# Altium project tcspc00.PrjPcb (part 2 of 2)

## Sheet 03_mcu_display.SchDoc
size A; SheetNumber: 14; SheetTotal: 17
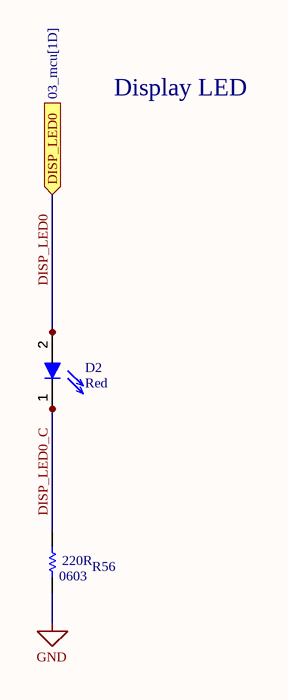
[diagram p8: 03_mcu_display.SchDoc]

### Parts
D2  Red  [DISPLAY-LED]
R56  RMCF0603JT220R  [RES-STACK-POLE-0603]  (value not drawn)

### Ports
DISP_LED0 (in, see 03_mcu[1D])

### Nets
GND: R56.1
DISP_LED0: D2.2 ; port DISP_LED0
DISP_LED0_C: D2.1 R56.2

### Notes on the sheet
- Display LED
- (in symbol RMCF0603JT220R) 220R; 0603

### Library data of the parts
D2 = LTST-C191KRKT: LED RED CLEAR 0603 SMD; Manufacturer: Vishay Lite-On; Lens Color: Colorless; Power Rating: 75mW; Luminous Intensity: 54mcd; Viewing Angle: 130°; Forward Voltage: 2V; Lens Style: Clear,Diffused,Colorless,Rectangular; Forward Current: 30mA; Dominant Wavelength: 631nm; Test Current: 20mA; Number of Elements: 1; Wavelength: 639nm; Reverse Voltage: 5V; Supplier 1: Digi-Key; Manufacturer Part Number: LTST-C191KRKT; RoHS: Yes; Category: LEDs; Stock 1: 515395; Pricing 1: 1=0.26000, 10=0.14100, 100=0.06560, 500=0.06060, 1000=0.04747, 2000=0.04646 (USD); Mount: Surface Mount; Case/Package: 0603; Number of Pins: 2; Color: Red; Case Code (Metric): 1608; Case Code (Imperial): 0603; Min Operating Temperature: -55°C; Max Operating Temperature: 85°C; Packaging: Tape and Reel; Package Quantity: 1; Illumination Color: Red; Lens Transparency: Clear; Power Dissipation: 75mW; Number of LEDs: 1; Voltage: 2V; Length: 1.6mm; Width: 0.8mm; Height: 0.55mm; Depth: 0.8mm; Radiation Hardening: No; Lead Free: Lead Free; RoHS Compliant: Yes; ComponentLink1URL: https://datasheet.ciiva.com/12400/lite-on-ltst-c191krkt-190135-12400910.pdf?src-supplier=Mouser; ComponentLink1Description: https://datasheet.ciiva.com/12400/lite-on-ltst-c191krkt-190135-12400910.pdf?src-supplier=Mouser; ComponentLink2URL: https://datasheet.ciiva.com/16212/ltst-c191krkt-16212419.pdf?src-supplier=Future+Electronics; ComponentLink2Description: https://datasheet.ciiva.com/16212/ltst-c191krkt-16212419.pdf?src-supplier=Future+Electronics; ComponentLink3URL: https://datasheet.ciiva.com/15117/getdatasheetpartid-141922-15117737.pdf?src-supplier=Verical; ComponentLink3Description: https://datasheet.ciiva.com/15117/getdatasheetpartid-141922-15117737.pdf?src-supplier=Verical; ComponentLink4URL: https://datasheet.ciiva.com/11773/0900766b80dc02b2-11773601.pdf?src-supplier=RSComponents; ComponentLink4Description: https://datasheet.ciiva.com/11773/0900766b80dc02b2-11773601.pdf?src-supplier=RSComponents; ComponentLink5URL: https://datasheet.ciiva.com/2109/s-110-ltst-c191krkt-2109970.pdf?src-supplier=Digi-Key; ComponentLink5Description: https://datasheet.ciiva.com/2109/s-110-ltst-c191krkt-2109970.pdf?src-supplier=Digi-Key; ComponentLink6URL: https://datasheet.ciiva.com/2109/s-110-ltst-c191krkt-2109971.pdf?src-supplier=Digi-Key; ComponentLink6Description: https://datasheet.ciiva.com/2109/s-110-ltst-c191krkt-2109971.pdf?src-supplier=Digi-Key; ComponentLink7URL: https://datasheet.ciiva.com/2109/s-110-ltst-c191krkt-2109972.pdf?src-supplier=Digi-Key; ComponentLink7Description: https://datasheet.ciiva.com/2109/s-110-ltst-c191krkt-2109972.pdf?src-supplier=Digi-Key; Supplier Part Number 1: 160-1447-1-ND
R56 = RMCF0603JT220R: RES 220 OHM 5% 1/10W 0603; Supplier 1: Digi-Key; Supplier Part Number 1: RMCF0603JT220RCT-ND

## Sheet 03_mcu_io.SchDoc
size A; SheetNumber: 15; SheetTotal: 17
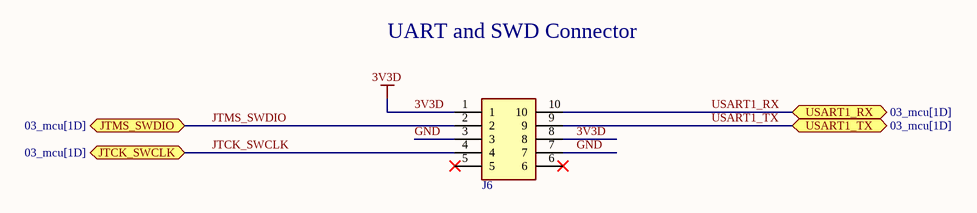
[diagram p9: 03_mcu_io.SchDoc]

### Parts
J6  TC2050-IDC  [TAG-CONNECT_TC2050-IDC]  (value not drawn)

### Ports
JTCK_SWCLK (bidir, see 03_mcu[1D]), JTMS_SWDIO (bidir, see 03_mcu[1D]), USART1_RX (bidir, see 03_mcu[1D]), USART1_TX (bidir, see 03_mcu[1D])

### Nets
3V3D: J6.1 J6.8
GND: J6.3 J6.7
JTCK_SWCLK: J6.4 ; port JTCK_SWCLK
JTMS_SWDIO: J6.2 ; port JTMS_SWDIO
USART1_RX: J6.10 ; port USART1_RX
USART1_TX: J6.9 ; port USART1_TX

Not connected (* = marked no-connect by the designer): J6 5* 6*

### Notes on the sheet
- UART and SWD Connector

### Library data of the parts
J6 = TC2050-IDC: Cbl Plug-Of-Nails 10-Pin w/Legs; Package: None; Availability: Unavailable; Value: *; MP: TC2050-IDC; Price: None

## Sheet 02_power_supply.SchDoc
size A3; SheetNumber: 6; SheetTotal: 17
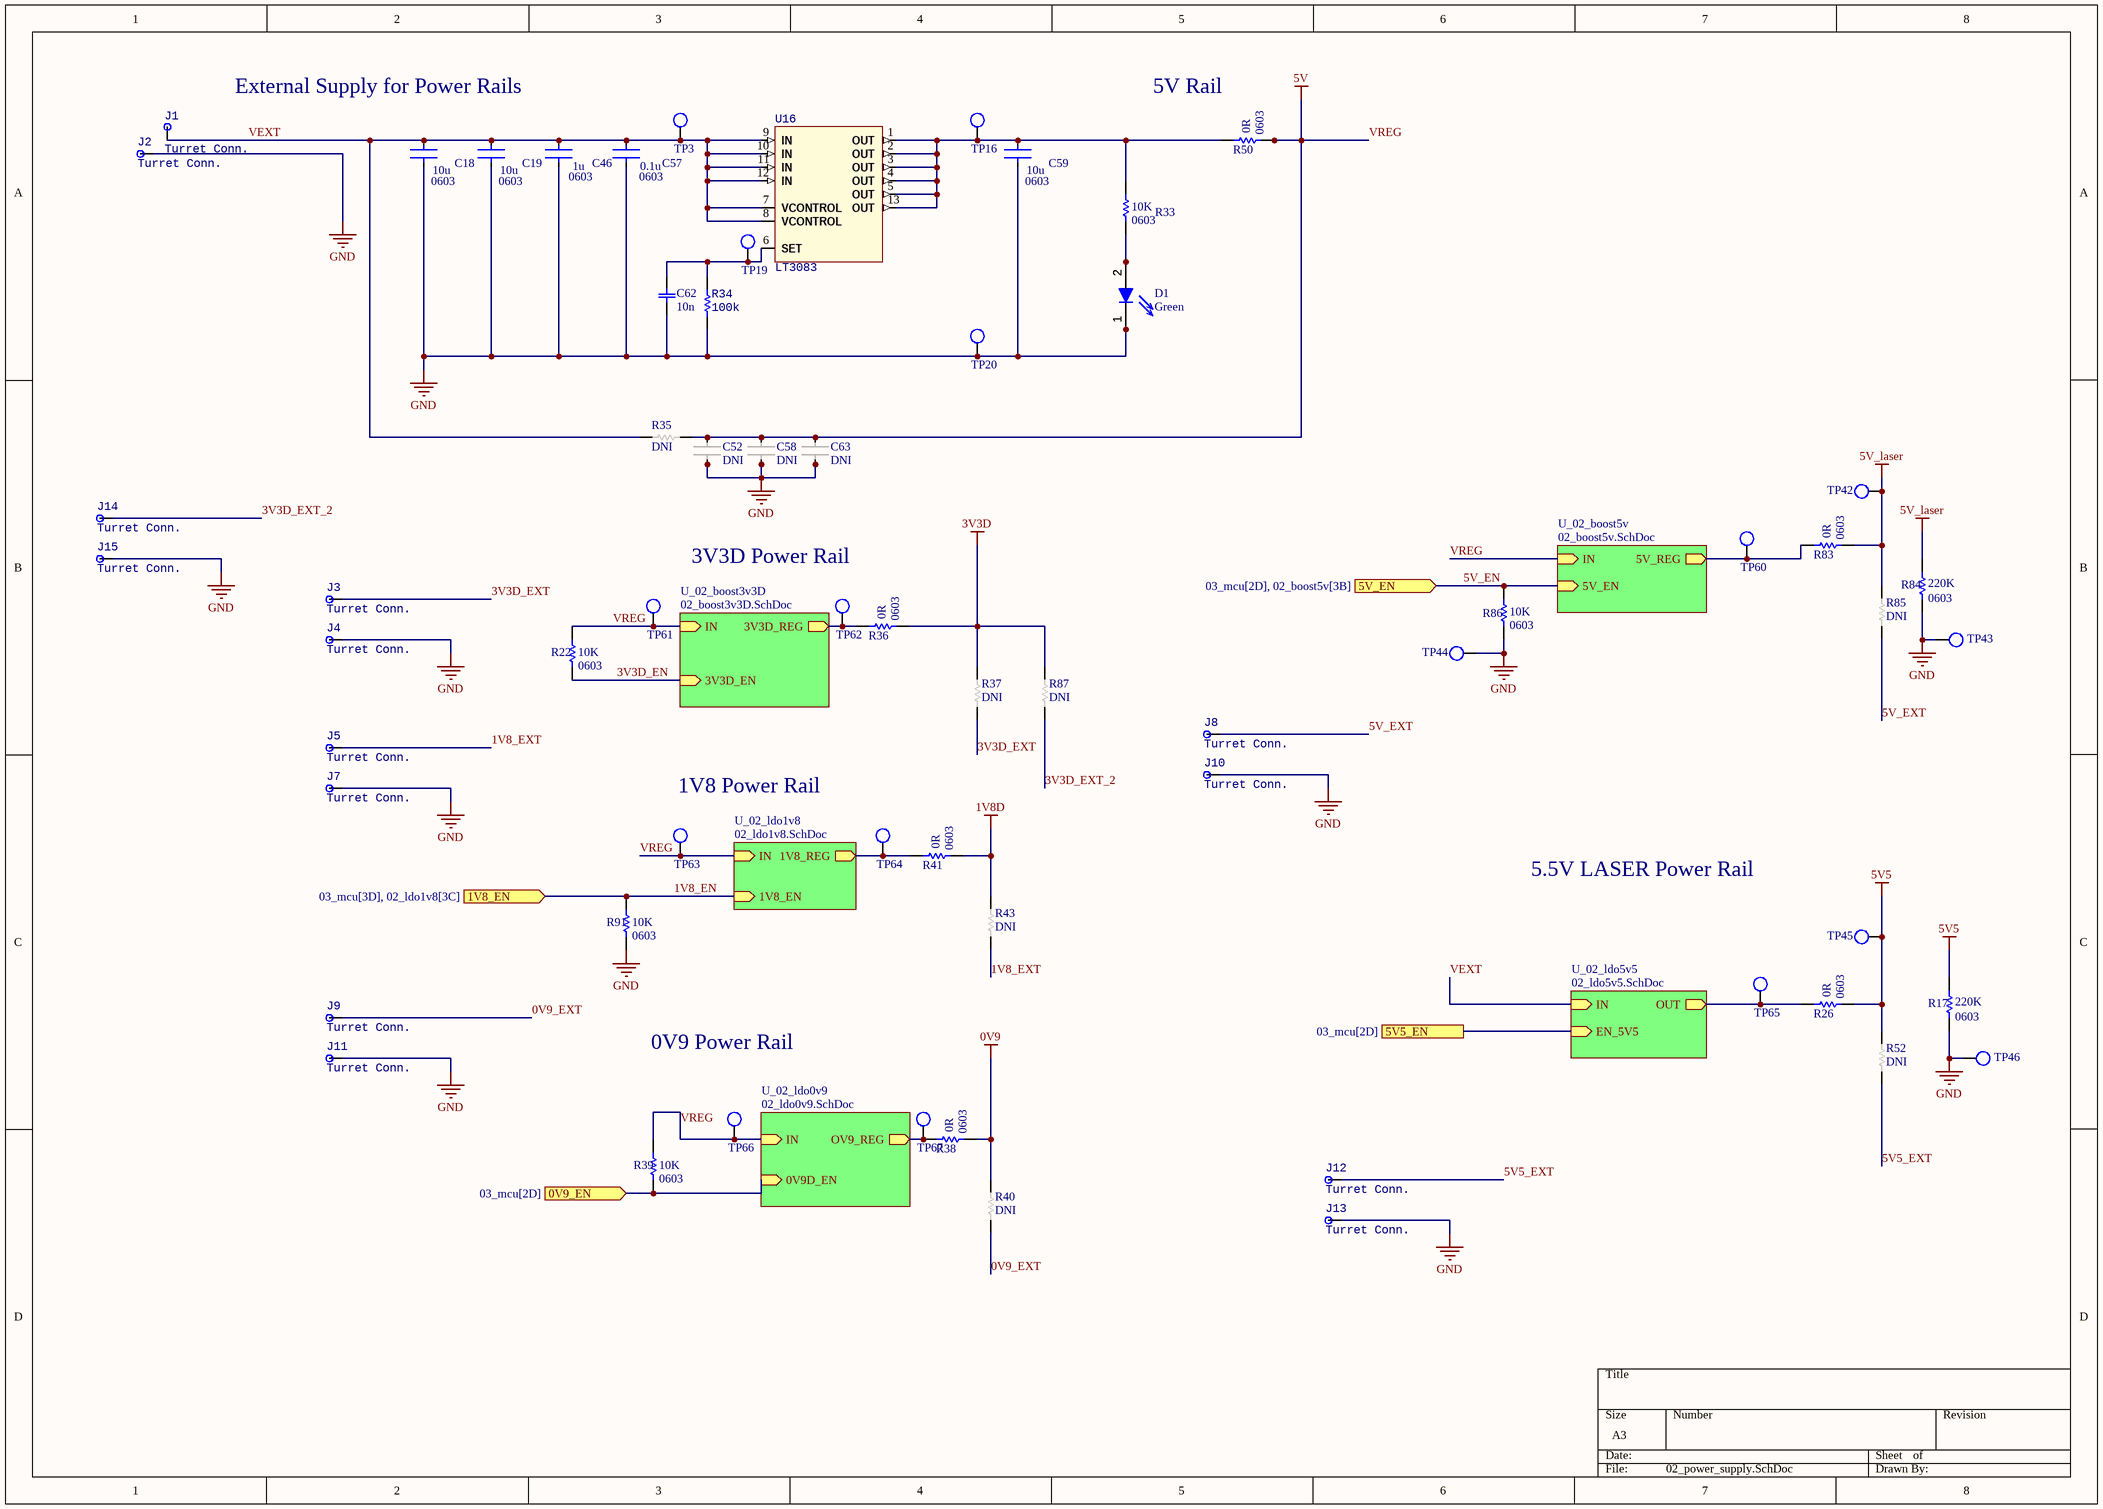
[diagram p10: 02_power_supply.SchDoc]

### Parts
C18  C1608X5R1A106K080AC  [CAPTDK0603]  (value not drawn)
C19  C1608X5R1A106K080AC  [CAPTDK0603]  (value not drawn)
C46  C1608X5R1E105K080AC  [CAPTDK0603]  (value not drawn)
C52  DNI  [CAPTDK0603]  (no BOM)
C57  CGA3E2X7R1H104K080AA  [CAPTDK0603]  (value not drawn)
C58  DNI  [CAPTDK0603]  (no BOM)
C59  C1608X5R1A106K080AC  [CAPTDK0603]  (value not drawn)
C62  10n  [CAP_CL10]
C63  DNI  [CAPTDK0603]  (no BOM)
D1  Green  [DISPLAY-LED]
J1  Turret Conn.  [2501-X]
J2  Turret Conn.  [2501-X]
J3  Turret Conn.  [2501-X]
J4  Turret Conn.  [2501-X]
J5  Turret Conn.  [2501-X]
J7  Turret Conn.  [2501-X]
J8  Turret Conn.  [2501-X]
J9  Turret Conn.  [2501-X]
J10  Turret Conn.  [2501-X]
J11  Turret Conn.  [2501-X]
J12  Turret Conn.  [2501-X]
J13  Turret Conn.  [2501-X]
J14  Turret Conn.  [2501-X]
J15  Turret Conn.  [2501-X]
R17  RMCF0603FT220K  [RES-STACK-POLE-0603]  (value not drawn)
R22  RMCF0603JG10K0  [RES-STACK-POLE-0603]  (value not drawn)
R26  RMCF0603ZT0R00  [RES-STACK-POLE-0603]  (value not drawn)
R33  RMCF0603JG10K0  [RES-STACK-POLE-0603]  (value not drawn)
R34  100k  [RES_0603]
R35  DNI  [RES_0603]
R36  RMCF0603ZT0R00  [RES-STACK-POLE-0603]  (value not drawn)
R37  DNI  [RES_0603]
R38  RMCF0603ZT0R00  [RES-STACK-POLE-0603]  (value not drawn)
R39  RMCF0603JG10K0  [RES-STACK-POLE-0603]  (value not drawn)
R40  DNI  [RES_0603]
R41  RMCF0603ZT0R00  [RES-STACK-POLE-0603]  (value not drawn)
R43  DNI  [RES_0603]
R50  RMCF0603ZT0R00  [RES-STACK-POLE-0603]  (value not drawn)
R52  DNI  [RES_0603]
R83  RMCF0603ZT0R00  [RES-STACK-POLE-0603]  (value not drawn)
R84  RMCF0603FT220K  [RES-STACK-POLE-0603]  (value not drawn)
R85  DNI  [RES_0603]
R86  RMCF0603JG10K0  [RES-STACK-POLE-0603]  (value not drawn)
R87  DNI  [RES_0603]
R91  RMCF0603JG10K0  [RES-STACK-POLE-0603]  (value not drawn)
TP3  TESTPOINT_S  [TESTPOINT_S]  (value not drawn)  (no BOM)
TP16  TESTPOINT_S  [TESTPOINT_S]  (value not drawn)  (no BOM)
TP19  TESTPOINT_S  [TESTPOINT_S]  (value not drawn)  (no BOM)
TP20  TESTPOINT_S  [TESTPOINT_S]  (value not drawn)  (no BOM)
TP42  TESTPOINT_S  [TESTPOINT_S]  (value not drawn)  (no BOM)
TP43  TESTPOINT_S  [TESTPOINT_S]  (value not drawn)  (no BOM)
TP44  TESTPOINT_S  [TESTPOINT_S]  (value not drawn)  (no BOM)
TP45  TESTPOINT_S  [TESTPOINT_S]  (value not drawn)  (no BOM)
TP46  TESTPOINT_S  [TESTPOINT_S]  (value not drawn)  (no BOM)
TP60  TESTPOINT_S  [TESTPOINT_S]  (value not drawn)  (no BOM)
TP61  TESTPOINT_S  [TESTPOINT_S]  (value not drawn)  (no BOM)
TP62  TESTPOINT_S  [TESTPOINT_S]  (value not drawn)  (no BOM)
TP63  TESTPOINT_S  [TESTPOINT_S]  (value not drawn)  (no BOM)
TP64  TESTPOINT_S  [TESTPOINT_S]  (value not drawn)  (no BOM)
TP65  TESTPOINT_S  [TESTPOINT_S]  (value not drawn)  (no BOM)
TP66  TESTPOINT_S  [TESTPOINT_S]  (value not drawn)  (no BOM)
TP67  TESTPOINT_S  [TESTPOINT_S]  (value not drawn)  (no BOM)
U16  LT3083  [DF-12_LT3083]

### Sub-sheets
U_02_boost3v3D = 02_boost3v3D.SchDoc: IN (in), 3V3D_EN (in), 3V3D_REG (out)
U_02_boost5v = 02_boost5v.SchDoc: IN (in), 5V_EN (in), 5V_REG (out)
U_02_ldo0v9 = 02_ldo0v9.SchDoc (file not in this document): IN (in), 0V9D_EN (in), OV9_REG (out)
U_02_ldo1v8 = 02_ldo1v8.SchDoc: IN (in), 1V8_EN (in), 1V8_REG (out)
U_02_ldo5v5 = 02_ldo5v5.SchDoc: IN (in), OUT (out), EN_5V5 (in)

### Ports
0V9_EN (in, see 03_mcu[2D]), 1V8_EN (in, see 03_mcu[3D], 02_ldo1v8[3C]), 5V5_EN (see 03_mcu[2D]), 5V_EN (in, see 03_mcu[2D], 02_boost5v[3B])

### Nets
0V9: R38.1 R40.1
1V8D: R41.1 R43.1
3V3D: R36.1 R37.1 R87.1
5V5: R17.2 R26.1 R52.1 TP45.1
5V_laser: R83.1 R84.2 R85.1 TP42.1
GND: C18.2 C19.2 C46.2 C52.2 C57.2 C58.2 C59.2 C62.1 C63.2 D1.1 J2.1 J4.1 J7.1 J10.1 J11.1 J13.1 J15.1 R17.1 R34.1 R84.1 R86.1 R91.1 TP20.1 TP43.1 TP44.1 TP46.1
VREG: C52.1 C58.1 C63.1 R22.2 R35.2 R39.2 R50.1 TP61.1 TP63.1 TP66.1 ; sheet U_02_ldo1v8/IN, sheet U_02_boost3v3D/IN, sheet U_02_ldo0v9/IN, sheet U_02_boost5v/IN  [also labelled 5V]
0V9_EN: R39.1 ; port 0V9_EN, sheet U_02_ldo0v9/0V9D_EN
0V9_EXT: J9.1 R40.2
1V8_EN: R91.2 ; port 1V8_EN, sheet U_02_ldo1v8/1V8_EN
1V8_EXT: J5.1 R43.2
3V3D_EN: R22.1 ; sheet U_02_boost3v3D/3V3D_EN
3V3D_EXT: J3.1 R37.2
3V3D_EXT_2: J14.1 R87.2
5V5_EN: port 5V5_EN, sheet U_02_ldo5v5/EN_5V5
5V5_EXT: J12.1 R52.2
5V_EN: R86.2 ; port 5V_EN, sheet U_02_boost5v/5V_EN
5V_EXT: J8.1 R85.2
VEXT: C18.1 C19.1 C46.1 C57.1 J1.1 R35.1 TP3.1 U16.7(VCONTROL) U16.8(VCONTROL) U16.9(IN) U16.10(IN) U16.11(IN) U16.12(IN) ; sheet U_02_ldo5v5/IN
NetC40_1: R41.2 TP64.1 ; sheet U_02_ldo1v8/1V8_REG
NetC43_1: R36.2 TP62.1 ; sheet U_02_boost3v3D/3V3D_REG
NetC59_1: C59.1 R33.2 R50.2 TP16.1 U16.1(OUT) U16.2(OUT) U16.3(OUT) U16.4(OUT) U16.5(OUT) U16.13(OUT)
NetC62_2: C62.2 R34.2 TP19.1 U16.6(SET)
NetC116_1: R83.2 TP60.1 ; sheet U_02_boost5v/5V_REG
NetC120_1: R26.2 TP65.1 ; sheet U_02_ldo5v5/OUT
NetD1_2: D1.2 R33.1
NetR38_2: R38.2 TP67.1 ; sheet U_02_ldo0v9/OV9_REG

### Notes on the sheet
- External Supply for Power Rails
- (near R50) 5V Rail
- 3V3D Power Rail
- 1V8 Power Rail
- 5.5V LASER Power Rail
- 0V9 Power Rail
- (in symbol C1608X5R1A106K080AC) 10u; 0603
- (in symbol C1608X5R1E105K080AC) 1u; 0603
- (in symbol CGA3E2X7R1H104K080AA) 0.1u; 0603
- (in symbol RMCF0603FT220K) 220K; 0603
- (in symbol RMCF0603JG10K0) 10K; 0603
- (in symbol RMCF0603ZT0R00) 0R; 0603

### Library data of the parts
C18 C19 C59 = C1608X5R1A106K080AC: CAP CER 10UF 10V X5R 0603; Supplier 1: Digi-Key; Supplier Part Number 1: 445-C1608X5R1A106K080ACCT-ND
C46 = C1608X5R1E105K080AC: CAP CER 1UF 25V X5R 0603; Supplier 1: Digi-Key; Supplier Part Number 1: 445-5146-1-ND
C52 C58 C63 = C0402_PROVISION: CAP PROVISION 0603; Value: DNI
C57 = CGA3E2X7R1H104K080AA: CAP CER 0.1UF 50V X7R 0603; Supplier 1: Digi-Key; Supplier Part Number 1: 445-5666-1-ND
C62 = CC0603KRX7R9BB103: CAP CER 10NF 50V X7R 0603; Manufacturer: Yageo; Material: Ceramic; Tolerance: 10%; Insulation Resistance: 100GR; Supplier 1: Digi-Key; Manufacturer Part Number: CC0603KRX7R9BB103; RoHS: Yes; Category: Ceramic Capacitors; Stock 1: 11591344; Pricing 1: 4000=0.00734, 8000=0.00670 (USD); Mount: Surface Mount; Case/Package: 0603; Number of Pins: 2; Case Code (Metric): 1608; Case Code (Imperial): 0603; Min Operating Temperature: -55°C; Max Operating Temperature: 125°C; Capacitance: 10nF; Dielectric: X7R; Voltage: 50V; Packaging: Tape and Reel; Voltage Rating: 50V; Voltage Rating (DC): 50V; Package Quantity: 1; Termination: SMD/SMT; Resistor Type: Ceramic; Series: CC; Length: 1.6mm; Width: 0.031inch; Height: 0.8mm; Thickness: 0.035inch; Depth: 0.8mm; Radiation Hardening: No; RoHS Compliant: Yes; REACH SVHC: No SVHC; Lead Free: Lead Free; Halogen Free: Halogen Free; ComponentLink1URL: https://datasheet.ciiva.com/11788/0900766b8079c870-11788374.pdf?src-supplier=RSComponents; ComponentLink1Description: https://datasheet.ciiva.com/11788/0900766b8079c870-11788374.pdf?src-supplier=RSComponents; ComponentLink2URL: https://datasheet.ciiva.com/26862/getdatasheetpartid-403582-26862846.pdf?src-supplier=Verical; ComponentLink2Description: https://datasheet.ciiva.com/26862/getdatasheetpartid-403582-26862846.pdf?src-supplier=Verical; ComponentLink3URL: https://datasheet.ciiva.com/8033/70765-8033817.pdf?src-supplier=Element14; ComponentLink3Description: https://datasheet.ciiva.com/8033/70765-8033817.pdf?src-supplier=Element14; ComponentLink4URL: https://datasheet.ciiva.com/28450/1489800-28450619.pdf?src-supplier=Element14; ComponentLink4Description: https://datasheet.ciiva.com/28450/1489800-28450619.pdf?src-supplier=Element14; ComponentLink5URL: https://datasheet.ciiva.com/176/mlccorderingcode-176551.pdf?src-supplier=Digi-Key; ComponentLink5Description: https://datasheet.ciiva.com/176/mlccorderingcode-176551.pdf?src-supplier=Digi-Key; ComponentLink6URL: https://datasheet.ciiva.com/176/mlccorderingcode-176550.pdf?src-supplier=Digi-Key; ComponentLink6Description: https://datasheet.ciiva.com/176/mlccorderingcode-176550.pdf?src-supplier=Digi-Key; ComponentLink7URL: https://datasheet.ciiva.com/176/mlccorderingcode-176552.pdf?src-supplier=Digi-Key; ComponentLink7Description: https://datasheet.ciiva.com/176/mlccorderingcode-176552.pdf?src-supplier=Digi-Key; ComponentLink8URL: https://datasheet.ciiva.com/13389/upy-gphc-x7r-6-3v-to-50v-8-13389991.pdf?src-supplier=Mouser; ComponentLink8Description: https://datasheet.ciiva.com/13389/upy-gphc-x7r-6-3v-to-50v-8-13389991.pdf?src-supplier=Mouser; ComponentLink9URL: https://datasheet.ciiva.com/8033/1734573-8033816.pdf?src-supplier=Element14; ComponentLink9Description: https://datasheet.ciiva.com/8033/1734573-8033816.pdf?src-supplier=Element14; ComponentLink10URL: https://datasheet.ciiva.com/8033/1734573-8033861.pdf?src-supplier=Element14; ComponentLink10Description: https://datasheet.ciiva.com/8033/1734573-8033861.pdf?src-supplier=Element14; ComponentLink11URL: https://datasheet.ciiva.com/16625/upy-gphc-x7r-6-3v-to-50v-8-16625529.pdf?src-supplier=Avnet+Europe; ComponentLink11Description: https://datasheet.ciiva.com/16625/upy-gphc-x7r-6-3v-to-50v-8-16625529.pdf?src-supplier=Avnet+Europe; Supplier Part Number 1: 311-1085-2-ND; Value: 10nF
D1 = LTST-C191KGKT: LED GREEN CLEAR 0603  SMD; Supplier 1: Digi-Key; Supplier Part Number 1: 160-1446-1-ND
J1-J5 J7-J15 = 2501-2-00-80-00-00-07-0: TERM TURRET SINGLE L=5.56MM TIN; Manufacturer: Mill-Max; Gender: Male; Outside Diameter: 3.18mm; Hole Diameter: 0.094inch; Board Thickness: 1.57mm; Mounting Hole Diameter: 2.39mm; Pin Diameter: 0.047inch; Supplier 1: Digi-Key; Manufacturer Part Number: 2501-2-00-80-00-00-07-0; RoHS: Yes; Category: Terminals; Stock 1: 31575; Pricing 1: 1=0.26000, 10=0.22000, 25=0.19520, 50=0.18200, 100=0.16900, 250=0.14952, 500=0.14300, 1000=0.11701, 2500=0.10726 (USD); Mount: Through Hole; Material: Brass; Plating: Tin; Package Quantity: 500; Packaging: Bulk; Length: 0.328inch; Lead Free: Lead Free; RoHS Compliant: Yes; ComponentLink1URL: https://datasheet.ciiva.com/12487/2501-2-00-80-00-00-07-0-89719-12487471.pdf?src-supplier=Mouser; ComponentLink1Description: https://datasheet.ciiva.com/12487/2501-2-00-80-00-00-07-0-89719-12487471.pdf?src-supplier=Mouser; Supplier Part Number 1: ED90581-ND
R17 R84 = RMCF0603FT220K: RES 220K OHM 1% 1/10W 0603; Supplier 1: Digi-Key; Supplier Part Number 1: RMCF0603FT220KCT-ND
R22 R33 R39 R86 R91 = RMCF0603JG10K0: RES 10K OHM 5% 1/10W 0603; Supplier 1: Digi-Key; Supplier Part Number 1: 738-RMCF0603JG10K0CT-ND
R26 R36 R38 R41 R50 R83 = RMCF0603ZT0R00: RES 0 OHM JUMPER 1/10W 0603; Supplier 1: Digi-Key; Supplier Part Number 1: RMCF0603ZT0R00CT-ND
R34 = RMCF0603FT100K_1: RES 100K OHM 1% 1/10W 0603; Manufacturer: Stackpole Electronics; Resistance: 100kR; Power Rating: 100mW; Temperature Coefficient: 100ppm/°C; Working Voltage: 75V; Supplier 1: Digi-Key; Manufacturer Part Number: RMCF0603FT100K; RoHS: Yes; Category: Chip SMD Resistors; Stock 1: 8267885; Pricing 1: 1=0.10000, 10=0.01700, 100=0.00680, 1000=0.00305, 2500=0.00264 (USD); Mount: Surface Mount; Case/Package: 0603; Case Code (Metric): 1608; Case Code (Imperial): 0603; Contact Plating: Tin,Matte; Min Operating Temperature: -55°C; Max Operating Temperature: 155°C; Packaging: Tape and Reel; Series: RMCF; Tolerance: 1%; Resistor Type: Thick Film; Number of Terminations: 2; Max Power Dissipation: 100mW; Features: Automotive AEC-Q200; Construction: Rectangular; Length: 1.55mm; Width: 0.031inch; Height: 0.022inch; Depth: 0.8mm; Radiation Hardening: No; Military Standard: Not; Lead Free: Lead Free; RoHS Compliant: Yes; ComponentLink1URL: https://datasheet.ciiva.com/15193/getdatasheetpartid-362597-15193437.pdf?src-supplier=Verical; ComponentLink1Description: https://datasheet.ciiva.com/15193/getdatasheetpartid-362597-15193437.pdf?src-supplier=Verical; Supplier Part Number 1: RMCF0603FT100KCT-ND
R35 R37 R40 R43 R52 R85 R87 = R0603: RES DNI 0603
TP3 TP16 TP19 TP20 TP42-TP46 TP60-TP67 = TESTPOINT_S: Testpoint Surface Pad
U16 = LT3083EDF#PBF: IC REG LINEAR POS ADJ 3A 12DFN; Supplier 1: Digikey; Supplier Part Number 1: 505-LT3083EDF#PBF-ND

## Sheet 02_ldo1v8.SchDoc
size A; SheetNumber: 7; SheetTotal: 17
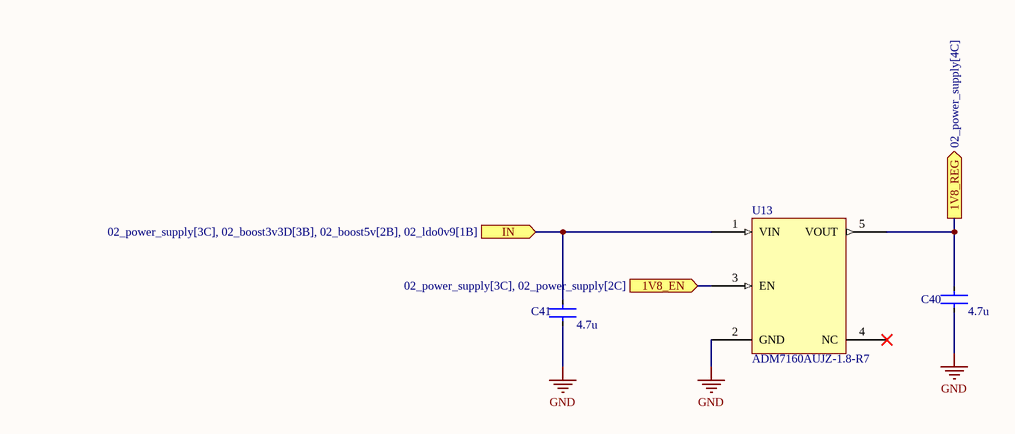
[diagram p11: 02_ldo1v8.SchDoc]

### Parts
C40  C1608X5R1E475K080AC  [CAPTDK0603]  (value not drawn)
C41  C1608X5R1E475K080AC  [CAPTDK0603]  (value not drawn)
U13  ADM7160AUJZ-1.8-R7  [ADM7160]

### Ports
1V8_EN (in, see 02_power_supply[3C], 02_power_supply[2C]), 1V8_REG (out, see 02_power_supply[4C]), IN (in, see 02_power_supply[3C], 02_boost3v3D[3B], 02_boost5v[2B], 02_ldo0v9[1B])

### Nets
GND: C40.2 C41.2 U13.2(GND)
VREG: C41.1 U13.1(VIN) ; port IN
1V8_EN: U13.3(EN) ; port 1V8_EN
NetC40_1: C40.1 U13.5(VOUT) ; port 1V8_REG

Not connected (* = marked no-connect by the designer): U13 4(NC)*

### Notes on the sheet
- (in symbol C1608X5R1E475K080AC) 4.7u

### Library data of the parts
C40 C41 = C1608X5R1E475K080AC: CAP CER 4.7UF 25V X5R 0603; Supplier 1: Digi-Key; Supplier Part Number 1: 445-9050-1-ND
U13 = ADM7160AUJZ-1.8-R7: IC REG LINEAR 1.8V 200MA TSOT5; Manufacturer: Analog Devices; Number of Regulators: 1; Min Current Limit: 220mA; Polarity: Positive; Quiescent Current: 10uA; Min Input Voltage: 2.2V; Accuracy: 1%; Max Input Voltage: 5.5V; Power Supply Rejection Ratio (PSRR): 49dB; Max Supply Current: 265uA; Output Type: Fixed; Supplier 1: Digi-Key; Manufacturer Part Number: ADM7160AUJZ-1.8-R7; RoHS: Yes; Category: Voltage Regulators - Linear; Stock 1: 830; Pricing 1: 1=1.57000, 10=1.40700, 25=1.33560, 100=1.09710, 250=1.02556, 500=0.90630, 1000=0.71550 (USD); Mount: Surface Mount; Case/Package: TSOT; Number of Pins: 5; Contact Plating: Tin,Matte; Min Operating Temperature: -40°C; Max Operating Temperature: 125°C; Packaging: Tape and Reel; Output Voltage: 1.8V; Output Current: 200mA; Number of Outputs: 1; Max Output Current: 200mA; Lead Free: Contains Lead; RoHS Compliant: Yes; ComponentLink1URL: http://www.analog.com/static/imported-files/data_sheets/ADM7160.pdf?src-supplier=Avnet; ComponentLink1Description: http://www.analog.com/static/imported-files/data_sheets/ADM7160.pdf?src-supplier=Avnet; ComponentLink2URL: http://www.analog.com/media/en/technical-documentation/data-sheets/ADM7160.pdf?src-supplier=Digi-Key; ComponentLink2Description: http://www.analog.com/media/en/technical-documentation/data-sheets/ADM7160.pdf?src-supplier=Digi-Key; ComponentLink3URL: https://www.analog.com/media/en/technical-documentation/data-sheets/ADM7160.pdf?src-supplier=Digi-Key; ComponentLink3Description: https://www.analog.com/media/en/technical-documentation/data-sheets/ADM7160.pdf?src-supplier=Digi-Key; Supplier Part Number 1: ADM7160AUJZ-1.8-R7CT-ND

## Sheet 02_boost3v3D.SchDoc
size A; SheetNumber: 8; SheetTotal: 17
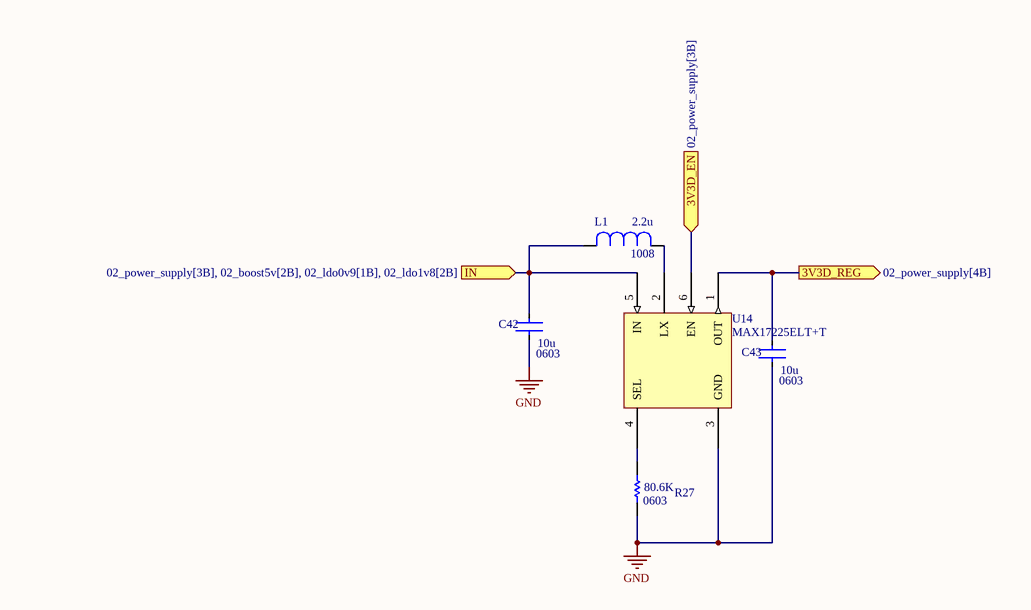
[diagram p12: 02_boost3v3D.SchDoc]

### Parts
C42  C1608X5R1A106K080AC  [CAPTDK0603]  (value not drawn)
C43  C1608X5R1A106K080AC  [CAPTDK0603]  (value not drawn)
L1  DFE252012P-2R2M=P2  [INDMURT1008]  (value not drawn)
R27  RMCF0603FT80K6  [RES-STACK-POLE-0603]  (value not drawn)
U14  MAX17225ELT+T  [MAX17222ELT+T]

### Ports
3V3D_EN (in, see 02_power_supply[3B]), 3V3D_REG (out, see 02_power_supply[4B]), IN (in, see 02_power_supply[3B], 02_boost5v[2B], 02_ldo0v9[1B], 02_ldo1v8[2B])

### Nets
GND: C42.2 C43.2 R27.1 U14.3(GND)
VREG: C42.1 L1.2 U14.5(IN) ; port IN
3V3D_EN: U14.6(EN) ; port 3V3D_EN
NetC43_1: C43.1 U14.1(OUT) ; port 3V3D_REG
NetL1_1: L1.1 U14.2(LX)
NetR27_2: R27.2 U14.4(SEL)

### Notes on the sheet
- (in symbol C1608X5R1A106K080AC) 10u; 0603
- (in symbol DFE252012P-2R2M=P2) 2.2u; 1008
- (in symbol RMCF0603FT80K6) 80.6K; 0603

### Library data of the parts
C42 C43 = C1608X5R1A106K080AC: CAP CER 10UF 10V X5R 0603; Supplier 1: Digi-Key; Supplier Part Number 1: 445-C1608X5R1A106K080ACCT-ND
L1 = DFE252012P-2R2M=P2: FIXED IND 2.2UH 2.2A 84 MOHM SMD; Mfr_Name: Murata; Type: DEV; Copyright: Copyright (C) 2022 Ultra Librarian. All rights reserved.; Manufacturer_Part_Number: DFE252012P-2R2M=P2; Digi-Key_Part_Number_1: 490-10649-1-ND; Digi-Key_Part_Number_2: 490-10649-2-ND; Digi-Key_Part_Number_3: 490-10649-6-ND; RefDes: RefDes; Supplier 1: Digi-Key; Supplier Part Number 1: 490-10649-1-ND
R27 = RMCF0603FT80K6: RES 80.6K OHM 1% 1/10W 0603; Mfr_Name: Stackpole International; Copyright: Copyright (C) 2022 Ultra Librarian. All rights reserved.; Manufacturer_Part_Number: RMCF0603FT80K6; Digi-Key_Part_Number_1: RMCF0603FT80K6CT-ND; Digi-Key_Part_Number_2: RMCF0603FT80K6DKR-ND; Digi-Key_Part_Number_3: RMCF0603FT80K6TR-ND; RefDes: RefDes; Type: DEV; Supplier 1: Digi-Key; Supplier Part Number 1: RMCF0603FT80K6CT-ND
U14 = MAX17225ELT+T: IC REG 0.9V TO 5V 1A 6UDFN; Mfr_Name: Maxim Integrated Products; Copyright: Copyright (C) 2022 Ultra Librarian. All rights reserved.; Manufacturer_Part_Number: MAX17225ELT+T; Digi-Key_Part_Number_1: MAX17225ELT+TTR-ND; Digi-Key_Part_Number_2: MAX17225ELT+TCT-ND; Digi-Key_Part_Number_3: MAX17225ELT+TDKR-ND; RefDes: RefDes; Type: DEV; Supplier 1: Mouser; Supplier Part Number 1: 700-MAX17225ELT+T

## Sheet 02_boost5v.SchDoc
size A; SheetNumber: 10; SheetTotal: 17
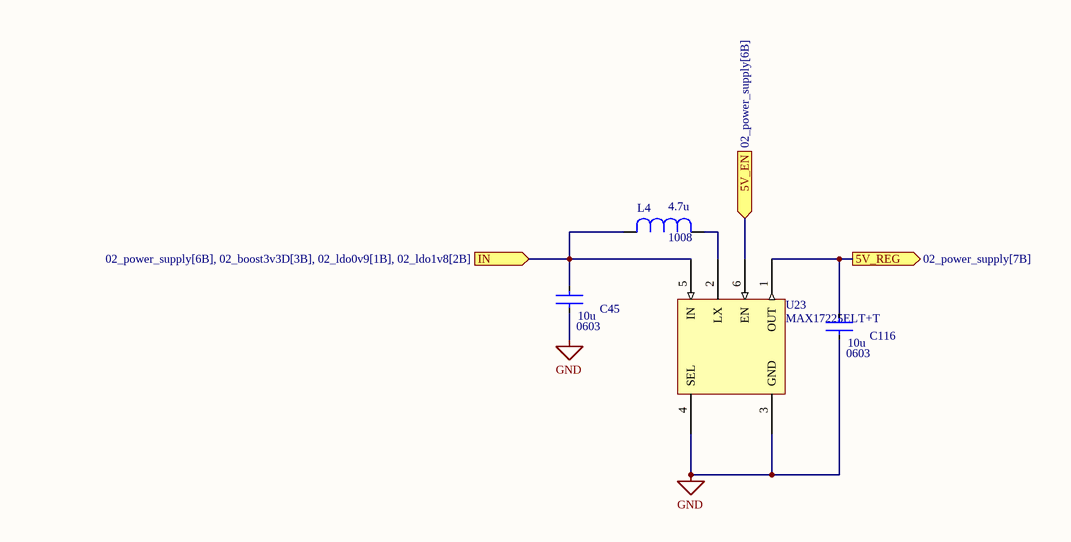
[diagram p13: 02_boost5v.SchDoc]

### Parts
C45  C1608X5R1A106K080AC  [CAPTDK0603]  (value not drawn)
C116  C1608X5R1A106K080AC  [CAPTDK0603]  (value not drawn)
L4  1269AS-H-4R7M=P2  [INDMURT1008]  (value not drawn)
U23  MAX17225ELT+T  [MAX17222ELT+T]

### Ports
5V_EN (in, see 02_power_supply[6B]), 5V_REG (out, see 02_power_supply[7B]), IN (in, see 02_power_supply[6B], 02_boost3v3D[3B], 02_ldo0v9[1B], 02_ldo1v8[2B])

### Nets
GND: C45.2 C116.2 U23.3(GND) U23.4(SEL)
VREG: C45.1 L4.2 U23.5(IN) ; port IN
5V_EN: U23.6(EN) ; port 5V_EN
NetC116_1: C116.1 U23.1(OUT) ; port 5V_REG
NetL4_1: L4.1 U23.2(LX)

### Notes on the sheet
- (in symbol 1269AS-H-4R7M=P2) 4.7u; 1008
- (in symbol C1608X5R1A106K080AC) 10u; 0603

### Library data of the parts
C45 C116 = C1608X5R1A106K080AC: CAP CER 10UF 10V X5R 0603; Supplier 1: Digi-Key; Supplier Part Number 1: 445-C1608X5R1A106K080ACCT-ND
L4 = 1269AS-H-4R7M=P2: FIXED IND 4.7UH 1.3A 300MOHM SMD; MF: Murata Electronics; Check_prices: https://www.snapeda.com/parts/1269AS-H-4R7M=P2/Murata%20Electronics%20North%20America/view-part/1502620/?ref=eda; Digi-Key_Part_Number: 490-10577-1-ND; SnapEDA_Link: https://www.snapeda.com/parts/1269AS-H-4R7M=P2/Murata%20Electronics%20North%20America/view-part/1502620/?ref=snap; Value: *; MP: 1269AS-H-4R7M=P2; Package: 2520 Murata; Purchase-URL: https://pricing.snapeda.com/search/part/1269AS-H-4R7M=P2/?ref=eda; Supplier 1: Digi-Key; Supplier Part Number 1: 490-10577-1-ND
U23 = MAX17225ELT+T: as U14 on sheet 02_boost3v3D; Copyright: Copyright (C) 2022 Ultra Librarian. All rights reserved.; Manufacturer_Part_Number: MAX17225ELT+T; Digi-Key_Part_Number_1: MAX17225ELT+TTR-ND; Digi-Key_Part_Number_2: MAX17225ELT+TCT-ND; Digi-Key_Part_Number_3: MAX17225ELT+TDKR-ND; RefDes: RefDes; Type: DEV; Supplier 1: Mouser; Supplier Part Number 1: 700-MAX17225ELT+T

## Sheet 02_ldo5v5.SchDoc
size A; SheetNumber: 10; SheetTotal: 18
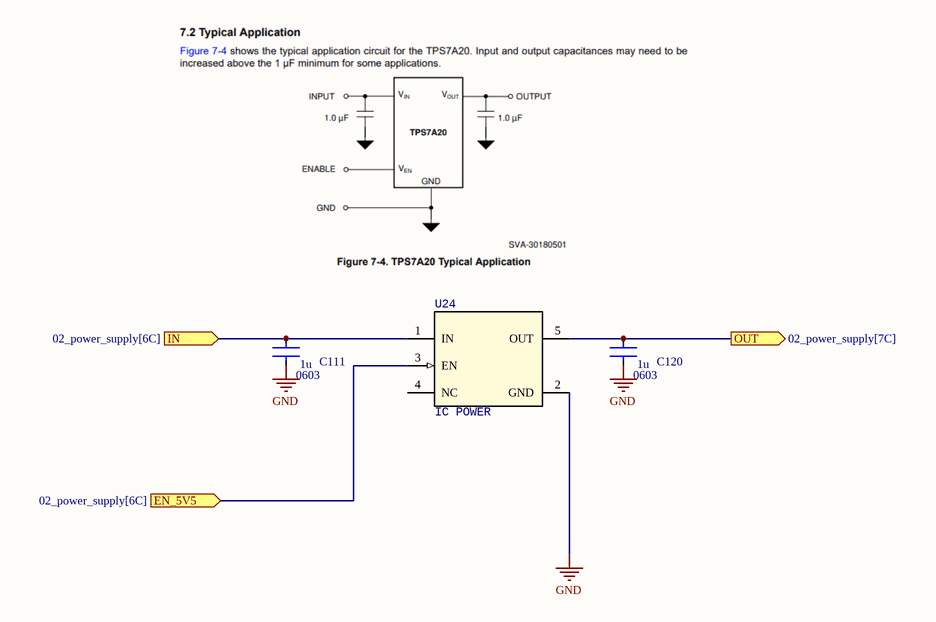
[diagram p14: 02_ldo5v5.SchDoc]

### Parts
C111  C1608X5R1E105K080AC  [CAPTDK0603]  (value not drawn)
C120  C1608X5R1E105K080AC  [CAPTDK0603]  (value not drawn)
U24  IC POWER  [SOT-23-5]

### Ports
EN_5V5 (in, see 02_power_supply[6C]), IN (in, see 02_power_supply[6C]), OUT (out, see 02_power_supply[7C])

### Nets
GND: C111.2 C120.2 U24.2(GND)
5V5_EN: U24.3(EN) ; port EN_5V5
VEXT: C111.1 U24.1(IN) ; port IN
NetC120_1: C120.1 U24.5(OUT) ; port OUT

Not connected (* = marked no-connect by the designer): U24 4(NC)

### Notes on the sheet
- (in symbol C1608X5R1E105K080AC) 1u; 0603

### Library data of the parts
C111 C120 = C1608X5R1E105K080AC: CAP CER 1UF 25V X5R 0603; Supplier 1: Digi-Key; Supplier Part Number 1: 445-5146-1-ND
U24 = TPS7A2055PDBVR: Linear Voltage Regulator IC Positive Fixed 1 Output 300mA SOT-23-5 5v5; Supplier 1: Digikey; Supplier Part Number 1: 296-TPS7A2055PDBVRCT-ND

## Sheet 01_detection_counter.SchDoc
size A3; SheetNumber: 3; SheetTotal: 17
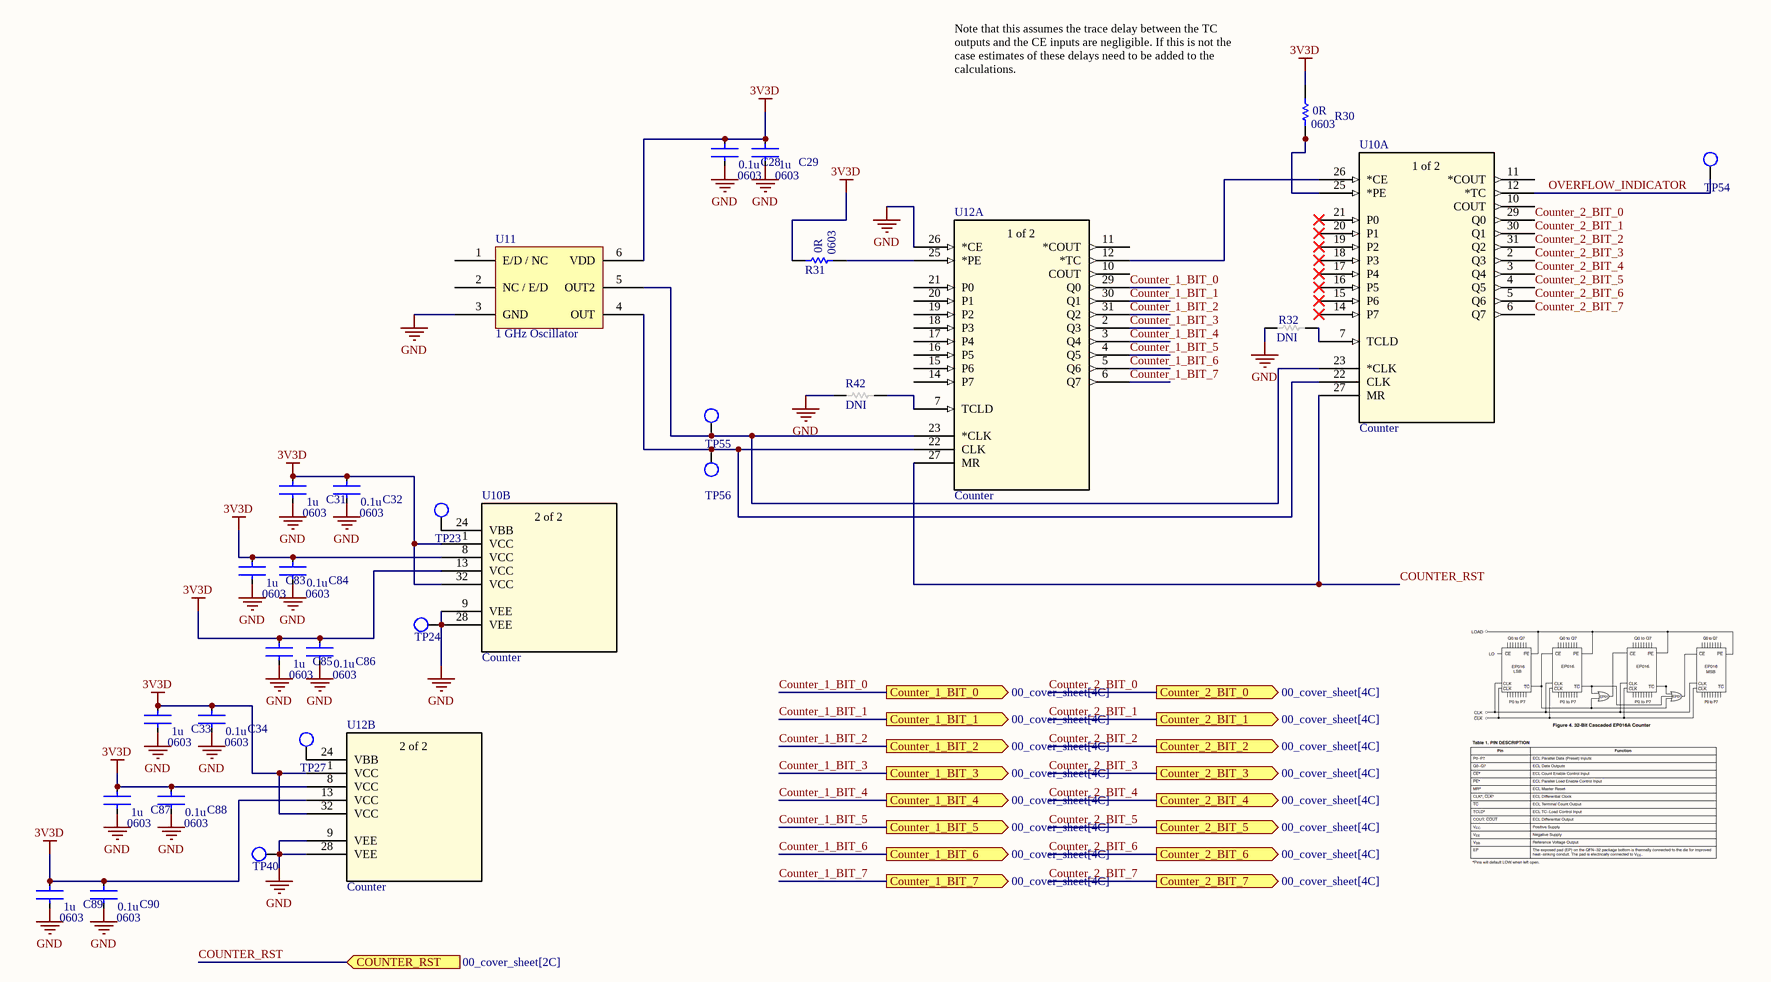
[diagram p15: 01_detection_counter.SchDoc]

### Parts
C28  CGA3E2X7R1H104K080AA  [CAPTDK0603]  (value not drawn)
C29  C1608X5R1E105K080AC  [CAPTDK0603]  (value not drawn)
C31  C1608X5R1E105K080AC  [CAPTDK0603]  (value not drawn)
C32  CGA3E2X7R1H104K080AA  [CAPTDK0603]  (value not drawn)
C33  C1608X5R1E105K080AC  [CAPTDK0603]  (value not drawn)
C34  CGA3E2X7R1H104K080AA  [CAPTDK0603]  (value not drawn)
C83  C1608X5R1E105K080AC  [CAPTDK0603]  (value not drawn)
C84  CGA3E2X7R1H104K080AA  [CAPTDK0603]  (value not drawn)
C85  C1608X5R1E105K080AC  [CAPTDK0603]  (value not drawn)
C86  CGA3E2X7R1H104K080AA  [CAPTDK0603]  (value not drawn)
C87  C1608X5R1E105K080AC  [CAPTDK0603]  (value not drawn)
C88  CGA3E2X7R1H104K080AA  [CAPTDK0603]  (value not drawn)
C89  C1608X5R1E105K080AC  [CAPTDK0603]  (value not drawn)
C90  CGA3E2X7R1H104K080AA  [CAPTDK0603]  (value not drawn)
R30  RMCF0603ZT0R00  [RES-STACK-POLE-0603]  (value not drawn)
R31  RMCF0603ZT0R00  [RES-STACK-POLE-0603]  (value not drawn)
R32  DNI  [RES_0603]
R42  DNI  [RES_0603]
TP23  TESTPOINT_S  [TESTPOINT_S]  (value not drawn)  (no BOM)
TP24  TESTPOINT_S  [TESTPOINT_S]  (value not drawn)  (no BOM)
TP27  TESTPOINT_S  [TESTPOINT_S]  (value not drawn)  (no BOM)
TP40  TESTPOINT_S  [TESTPOINT_S]  (value not drawn)  (no BOM)
TP54  TESTPOINT_S  [TESTPOINT_S]  (value not drawn)  (no BOM)
TP55  TESTPOINT_S  [TESTPOINT_S]  (value not drawn)  (no BOM)
TP56  TESTPOINT_S  [TESTPOINT_S]  (value not drawn)  (no BOM)
U10  Counter  [LQFP32_7X7_ONS]  (parts A,B of 2)
U11  1 GHz Oscillator  [XLP736A00.0000001]
U12  Counter  [LQFP32_7X7_ONS]  (parts A,B of 2)

### Ports
Counter_1_BIT_0 (out, see 00_cover_sheet[4C]), Counter_1_BIT_1 (out, see 00_cover_sheet[4C]), Counter_1_BIT_2 (out, see 00_cover_sheet[4C]), Counter_1_BIT_3 (out, see 00_cover_sheet[4C]), Counter_1_BIT_4 (out, see 00_cover_sheet[4C]), Counter_1_BIT_5 (out, see 00_cover_sheet[4C]), Counter_1_BIT_6 (out, see 00_cover_sheet[4C]), Counter_1_BIT_7 (out, see 00_cover_sheet[4C]), Counter_2_BIT_0 (out, see 00_cover_sheet[4C]), Counter_2_BIT_1 (out, see 00_cover_sheet[4C]), Counter_2_BIT_2 (out, see 00_cover_sheet[4C]), Counter_2_BIT_3 (out, see 00_cover_sheet[4C]), Counter_2_BIT_4 (out, see 00_cover_sheet[4C]), Counter_2_BIT_5 (out, see 00_cover_sheet[4C]), Counter_2_BIT_6 (out, see 00_cover_sheet[4C]), Counter_2_BIT_7 (out, see 00_cover_sheet[4C]), COUNTER_RST (in, see 00_cover_sheet[2C])

### Nets
3V3D: C28.1 C29.1 C31.1 C32.1 C33.1 C34.1 C83.1 C84.1 C85.1 C86.1 C87.1 C88.1 C89.1 C90.1 R30.2 R31.2 U10.1(VCC) U10.8(VCC) U10.13(VCC) U10.32(VCC) U11.6(VDD) U12.1(VCC) U12.8(VCC) U12.13(VCC) U12.32(VCC)
GND: C28.2 C29.2 C31.2 C32.2 C33.2 C34.2 C83.2 C84.2 C85.2 C86.2 C87.2 C88.2 C89.2 C90.2 R32.1 R42.1 TP24.1 TP40.1 U10.9(VEE) U10.28(VEE) U11.3(GND) U12.9(VEE) U12.26(*CE) U12.28(VEE)
Counter_1_BIT_0: U12.29(Q0) ; port Counter_1_BIT_0
Counter_1_BIT_1: U12.30(Q1) ; port Counter_1_BIT_1
Counter_1_BIT_2: U12.31(Q2) ; port Counter_1_BIT_2
Counter_1_BIT_3: U12.2(Q3) ; port Counter_1_BIT_3
Counter_1_BIT_4: U12.3(Q4) ; port Counter_1_BIT_4
Counter_1_BIT_5: U12.4(Q5) ; port Counter_1_BIT_5
Counter_1_BIT_6: U12.5(Q6) ; port Counter_1_BIT_6
Counter_1_BIT_7: U12.6(Q7) ; port Counter_1_BIT_7
Counter_2_BIT_0: U10.29(Q0) ; port Counter_2_BIT_0
Counter_2_BIT_1: U10.30(Q1) ; port Counter_2_BIT_1
Counter_2_BIT_2: U10.31(Q2) ; port Counter_2_BIT_2
Counter_2_BIT_3: U10.2(Q3) ; port Counter_2_BIT_3
Counter_2_BIT_4: U10.3(Q4) ; port Counter_2_BIT_4
Counter_2_BIT_5: U10.4(Q5) ; port Counter_2_BIT_5
Counter_2_BIT_6: U10.5(Q6) ; port Counter_2_BIT_6
Counter_2_BIT_7: U10.6(Q7) ; port Counter_2_BIT_7
COUNTER_RST: U10.27(MR) U12.27(MR) ; port COUNTER_RST
OVERFLOW_INDICATOR: TP54.1 U10.12(*TC)
NetR30_1: R30.1 U10.25(*PE)
NetR31_1: R31.1 U12.25(*PE)
NetR32_2: R32.2 U10.7(TCLD)
NetR42_2: R42.2 U12.7(TCLD)
NetTP23_1: TP23.1 U10.24(VBB)
NetTP27_1: TP27.1 U12.24(VBB)
NetTP55_1: TP55.1 U10.23(*CLK) U11.5(OUT2) U12.23(*CLK)
NetTP56_1: TP56.1 U10.22(CLK) U11.4(OUT) U12.22(CLK)
NetU10_26: U10.26(*CE) U12.12(*TC)

Not connected (* = marked no-connect by the designer): U10 10(COUT) 11(*COUT) 14(P7)* 15(P6)* 16(P5)* 17(P4)* 18(P3)* 19(P2)* 20(P1)* 21(P0)*; U11 1(E/D_/_NC) 2(NC_/_E/D); U12 10(COUT) 11(*COUT) 14(P7) 15(P6) 16(P5) 17(P4) 18(P3) 19(P2) 20(P1) 21(P0)

### Notes on the sheet
- Note that this assumes the trace delay between the TC
  outputs and the CE inputs are negligible. If this is not the
  case estimates of these delays need to be added to the
  calculations.
- (in symbol C1608X5R1E105K080AC) 1u; 0603
- (in symbol CGA3E2X7R1H104K080AA) 0.1u; 0603
- (in symbol MC100EP016AFAG, part A) 1 of 2
- (in symbol MC100EP016AFAG, part B) 2 of 2
- (in symbol RMCF0603ZT0R00) 0R; 0603

### Library data of the parts
C28 C32 C34 C84 C86 C88 C90 = CGA3E2X7R1H104K080AA: CAP CER 0.1UF 50V X7R 0603; Supplier 1: Digi-Key; Supplier Part Number 1: 445-5666-1-ND
C29 C31 C33 C83 C85 C87 C89 = C1608X5R1E105K080AC: CAP CER 1UF 25V X5R 0603; Supplier 1: Digi-Key; Supplier Part Number 1: 445-5146-1-ND
R30 R31 = RMCF0603ZT0R00: RES 0 OHM JUMPER 1/10W 0603; Supplier 1: Digi-Key; Supplier Part Number 1: RMCF0603ZT0R00CT-ND
R32 R42 = R0603: RES DNI 0603
TP23 TP24 TP27 TP40 TP54-TP56 = TESTPOINT_S: Testpoint Surface Pad
U10 U12 = MC100EP016AFAG: IC BINARY COUNTER 8-BIT 32LQFP; Mfr_Name: onsemi; RefDes: RefDes; Type: Type; Supplier 1: Digikey; Supplier Part Number 1: MC100EP016AFAGOS-ND
U11 = XLP736A00.000000I: 1 GHz XO (Standard) LVPECL Oscillator 3.3V Enable/Disable 6-SMD, No Lead 800-4305-ND  XLP736A00.000000I XTAL OSC XO 1.0000GHZ LVPECL SMD; Manufacturer: Renesas Electronics Corporation

## Nets that join several sheets
0V9: 04_excitation (6 pins), 02_power_supply (R38.1 R40.1)
1V8D: 01_detection (17 pins), 02_power_supply (R41.1 R43.1)
3V3D: 01_detection (20 pins), 01_detection_tdc (6 pins), 04_excitation (6 pins), 03_mcu (32 pins), 03_mcu_oscillators (C53.1 R51.2 XTAL1.4), 03_mcu_switches (R53.2 R54.2), 03_mcu_io (J6.1 J6.8), 02_power_supply (R36.1 R37.1 R87.1), 01_detection_counter (25 pins)
5V5: 04_excitation (C121.1 C122.1 R71.2 R76.2), 02_power_supply (R17.2 R26.1 R52.1 TP45.1)
5V_laser: 04_excitation (24 pins), 02_power_supply (R83.1 R84.2 R85.1 TP42.1)
GND: 01_detection (45 pins), 02_power_mppc (12 pins), 01_detection_tdc (10 pins), 04_excitation (52 pins), 03_mcu (36 pins), 03_mcu_oscillators (5 pins), 03_mcu_switches (6 pins), 03_mcu_display (R56.1), 02_power_supply (26 pins), 02_ldo1v8 (C40.2 C41.2 U13.2), 02_boost3v3D (C42.2 C43.2 R27.1 U14.3), 02_boost5v (C45.2 C116.2 U23.3 U23.4), 02_ldo5v5 (C111.2 C120.2 U24.2), 01_detection_counter (24 pins)
VREG: 02_power_mppc (C37.1 IC1.1 R21.2), 02_power_supply (10 pins), 02_ldo1v8 (C41.1 U13.1), 02_boost3v3D (C42.1 L1.2 U14.5), 02_boost5v (C45.1 L4.2 U23.5)
0V9_EN: 03_mcu (U17.56), 02_power_supply (R39.1)
1V8_EN: 03_mcu (U17.115), 02_power_supply (R91.2), 02_ldo1v8 (U13.3)
3V3D_EN: 02_power_supply (R22.1), 02_boost3v3D (U14.6)
5V5_EN: 03_mcu (U17.55), 02_ldo5v5 (U24.3)
5V_EN: 03_mcu (U17.57), 02_power_supply (R86.2), 02_boost5v (U23.6)
BOOT0_MCU: 03_mcu (U17.138), 03_mcu_switches (R53.1 R55.2)
Counter_1_BIT_0: 03_mcu (U17.122), 01_detection_counter (U12.29)
Counter_1_BIT_1: 03_mcu (U17.123), 01_detection_counter (U12.30)
Counter_1_BIT_2: 03_mcu (U17.124), 01_detection_counter (U12.31)
Counter_1_BIT_3: 03_mcu (U17.125), 01_detection_counter (U12.2)
Counter_1_BIT_4: 03_mcu (U17.126), 01_detection_counter (U12.3)
Counter_1_BIT_5: 03_mcu (U17.127), 01_detection_counter (U12.4)
Counter_1_BIT_6: 03_mcu (U17.128), 01_detection_counter (U12.5)
Counter_1_BIT_7: 03_mcu (U17.129), 01_detection_counter (U12.6)
Counter_2_BIT_0: 03_mcu (U17.139), 01_detection_counter (U10.29)
Counter_2_BIT_1: 03_mcu (U17.140), 01_detection_counter (U10.30)
Counter_2_BIT_2: 03_mcu (U17.141), 01_detection_counter (U10.31)
Counter_2_BIT_3: 03_mcu (U17.1), 01_detection_counter (U10.2)
Counter_2_BIT_4: 03_mcu (U17.2), 01_detection_counter (U10.3)
Counter_2_BIT_5: 03_mcu (U17.3), 01_detection_counter (U10.4)
Counter_2_BIT_6: 03_mcu (U17.4), 01_detection_counter (U10.5)
Counter_2_BIT_7: 03_mcu (U17.5), 01_detection_counter (U10.6)
COUNTER_RST: 00_cover_sheet (R96.1), 01_detection_counter (U10.27 U12.27)
DISP_EN: 03_mcu (U17.14), 03_mcu_switches (C127.1 R54.1 SW1.2)
DISP_LED0: 03_mcu (U17.26), 03_mcu_display (D2.2)
HSE_OUT: 03_mcu (U17.23), 03_mcu_oscillators (C54.1 XTAL1.3)
JTCK_SWCLK: 03_mcu (U17.109), 03_mcu_io (J6.4)
JTMS_SWDIO: 03_mcu (U17.105), 03_mcu_io (J6.2)
LSE_IN: 03_mcu (U17.9), 03_mcu_oscillators (C55.1 XO1.1)
LSE_OUT: 03_mcu (U17.8), 03_mcu_oscillators (C56.1 XO1.2)
mppc_pwr: 01_detection (R2.2 R13.2), 02_power_mppc (C36.1 R18.2)
NetC40_1: 02_power_supply (R41.2 TP64.1), 02_ldo1v8 (C40.1 U13.5)
NetC43_1: 02_power_supply (R36.2 TP62.1), 02_boost3v3D (C43.1 U14.1)
NetC103_1: 04_excitation (C103.1 R68.2 TP32.1), 03_mcu (U17.41)
NetC105_1: 04_excitation (C105.1 R69.2 TP33.1), 03_mcu (U17.40)
NetC116_1: 02_power_supply (R83.2 TP60.1), 02_boost5v (C116.1 U23.1)
NetC120_1: 02_power_supply (R26.2 TP65.1), 02_ldo5v5 (C120.1 U24.5)
NetR65_2: 04_excitation (R65.2 U19.7), 03_mcu (U17.35)
NetR67_2: 04_excitation (R67.2 TP47.1), 03_mcu (U17.59)
NetR70_1: 00_cover_sheet (R78.2), 04_excitation (R70.1 R73.1), 03_mcu (U17.60)
NetR78_1: 00_cover_sheet (R78.1), 01_detection_tdc (U21.B1)
NetR82_1: 04_excitation (R82.1 TP58.1), 03_mcu (U17.69)
NetR88_1: 00_cover_sheet (R88.1), 03_mcu (U17.75)
NetR88_2: 00_cover_sheet (R88.2), 01_detection_tdc (U21.C5 U21.E3)
NetR90_1: 00_cover_sheet (R90.1), 03_mcu (U17.63)
NetR92_1: 00_cover_sheet (R92.1), 03_mcu (U17.76)
NetR93_1: 00_cover_sheet (R93.1), 03_mcu (U17.74)
NetR94_1: 00_cover_sheet (R94.1), 03_mcu (U17.66)
NetR95_1: 00_cover_sheet (R95.1), 03_mcu (U17.90)
NetR96_2: 00_cover_sheet (R96.2), 01_detection (TP22.1 U8.4)
NetTP18_1: 01_detection (TP18.1 U9.4), 01_detection_tdc (U21.E1)
NetTP39_1: 01_detection_tdc (TP39.1 U21.A1 U21.D1), 03_mcu (U17.81)
NetU17_45: 04_excitation (U19.16), 03_mcu (U17.45)
RESET: 03_mcu (U17.25), 03_mcu_switches (C128.1 D3.1 SW2.2)
RXD_C11204: 02_power_mppc (IC1.3), 03_mcu (U17.86)
S_LATCH_RST: 00_cover_sheet (TP26.1), 01_detection (U6.6), 03_mcu (U17.96)
SPI_CLOCK_TDC_25MHz: 00_cover_sheet (R93.2), 01_detection_tdc (U21.A5)
SPI_DATA_IN_TDC: 00_cover_sheet (R92.2), 01_detection_tdc (U21.D5)
TDC_CSB1: 00_cover_sheet (R94.2), 01_detection_tdc (U21.B5)
TDC_CSB2: 00_cover_sheet (R95.2), 01_detection_tdc (U21.E5)
TDC_ENABLE: 00_cover_sheet (R90.2), 01_detection_tdc (U21.A3)
TDC_INTB1: 01_detection_tdc (U21.B3), 03_mcu (U17.65)
TDC_INTB2: 01_detection_tdc (U21.D3), 03_mcu (U17.64)
TDC_TRIGG1: 01_detection_tdc (U21.A2), 03_mcu (U17.67)
TDC_TRIGG2: 01_detection_tdc (U21.D2), 03_mcu (U17.89)
TXD_C11204: 02_power_mppc (IC1.4), 03_mcu (U17.85)
USART1_RX: 03_mcu (U17.112), 03_mcu_io (J6.10)
USART1_TX: 03_mcu (U17.111), 03_mcu_io (J6.9)
VEXT: 02_power_supply (13 pins), 02_ldo5v5 (C111.1 U24.1)